# Altium schematic sheet Sheet4.SchDoc
size A1; PageSetup: Record=PageOptions|CenterHorizontal=True|CenterVertical=True|PrintScale=1.00|XCorrection=1.00|YCorrection=1.00|PrintKind=0|BorderSize=5000000|LeftOffset=0|BottomOffset=0|Orientation=2|PaperLength=1000|PaperWidth=1000|Scale=100|PaperSource=7|PrintQuality=-4|MediaType=1|DitherType=10|PaperKind=A4|PrintScaleMode=1
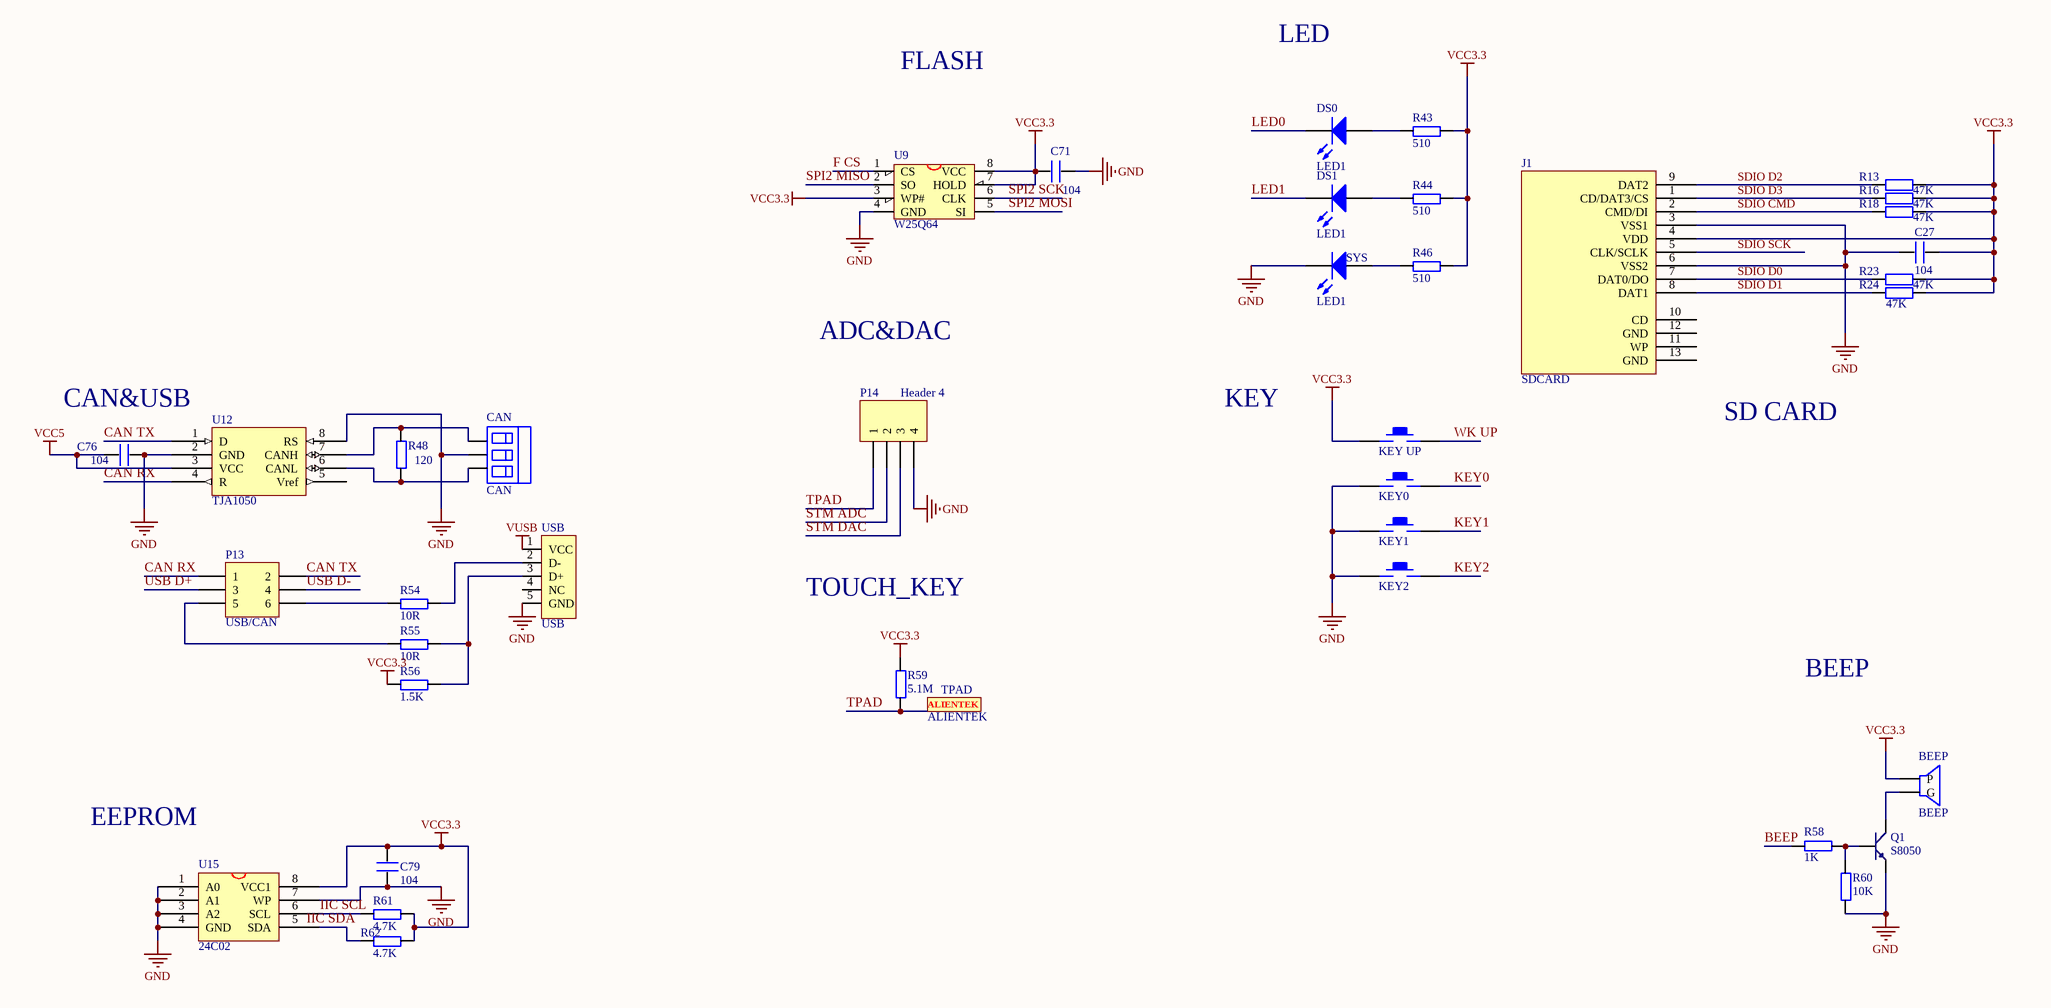
[diagram p0: Sheet4.SchDoc]

## Parts
BEEP  BEEP  [BELL-5]
C27  104  [0603P]
C71  104  [0603P]
C76  104  [0603P]
C79  104  [0603P]
CAN  CAN  [MKDSN_3RMI]
DS0  LED1  [SMDLED]
DS1  LED1  [SMDLED]
J1  SDCARD  [SDCARD_L]
KEY0  KEY_M  [KEY_M]  (value not drawn)
KEY1  KEY_M  [KEY_M]  (value not drawn)
KEY2  KEY_M  [KEY_M]  (value not drawn)
KEY_UP  KEY_M  [KEY_M]  (value not drawn)
P13  USB/CAN  [HDR2X3]
P14  Header 4  [HDR1X4]
Q1  S8050  [SOT-23R]
R13  value 47K  [0603-1]  (hidden comment: Res1)
R16  value 47K  [0603-1]  (hidden comment: Res1)
R18  value 47K  [0603-1]  (hidden comment: Res1)
R23  value 47K  [0603-1]  (hidden comment: Res1)
R24  value 47K  [0603-1]  (hidden comment: Res1)
R43  510  [0603P]
R44  510  [0603P]
R46  510  [0603P]
R48  120  [0603P]
R54  10R  [0603P]
R55  10R  [0603P]
R56  1.5K  [0603P]
R58  1K  [0603P]
R59  5.1M  [0603P]
R60  10K  [0603P]
R61  4.7K  [0603P]
R62  4.7K  [0603P]
SYS  LED1  [SMDLED]
TPAD  ALIENTEK  [ALIENTEK_PAD]
U9  W25Q64  [SOIC-8]
U12  TJA1050  [SOP-8]
U15  24C02  [SOP-8]
USB  USB  [USB/SM0.8-6H5]

## Nets
GND: C27.1 C71.2 C76.2 C79.1 CAN.2 J1.3(VSS1) J1.6(VSS2) KEY0.1 KEY1.1 KEY2.1 P14.4 Q1.1(E) R60.1 SYS.2(K) U9.4(GND) U12.2(GND) U12.8(RS) U15.1(A0) U15.2(A1) U15.3(A2) U15.4(GND) U15.7(WP) USB.5(GND)
VCC3.3: BEEP.1(P) C27.2 C71.1 C79.2 J1.4(VDD) KEY_UP.1 R13.2 R16.2 R18.2 R23.2 R24.2 R43.2 R44.2 R46.2 R56.1 R59.2 R61.2 R62.2 U9.3(WP#) U9.7(HOLD) U9.8(VCC) U15.8(VCC1)
VCC5: C76.1 U12.3(VCC)
VUSB: USB.1(VCC)
BEEP: R58.2
CAN RX: P13.1 U12.4(R)
CAN TX: P13.2 U12.1(D)
F CS: U9.1(CS)
IIC SCL: R61.1 U15.6(SCL)
KEY0: KEY0.2
KEY1: KEY1.2
KEY2: KEY2.2
LED0: DS0.2(K)
LED1: DS1.2(K)
SDIO CMD: J1.2(CMD/DI) R18.1
SDIO D0: J1.7(DAT0/DO) R23.1
SDIO D1: J1.8(DAT1) R24.1
SDIO D2: J1.9(DAT2) R13.1
SDIO D3: J1.1(CD/DAT3/CS) R16.1
SDIO SCK: J1.5(CLK/SCLK)
SPI2 MISO: U9.2(SO)
SPI2 MOSI: U9.5(SI)
SPI2 SCK: U9.6(CLK)
STM ADC: P14.2
STM DAC: P14.3
TPAD: P14.1 R59.1
USB D+: P13.3
USB D-: P13.4
WK UP: KEY_UP.2
NetBEEP_2: BEEP.2(G) Q1.3(C)
NetCAN_1: CAN.1 R48.2 U12.7(CANH)
NetCAN_3: CAN.3 R48.1 U12.6(CANL)
NetDS0_1: DS0.1(A) R43.1
NetDS1_1: DS1.1(A) R44.1
NetP13_5: P13.5 R55.1
NetP13_6: P13.6 R54.1
NetQ1_2: Q1.2(B) R58.1 R60.2
NetR46_1: R46.1 SYS.1(A)
NetR54_2: R54.2 USB.2(D-)
NetR55_2: R55.2 R56.2 USB.3(D+)
NetR62_1: R62.1 U15.5(SDA)

Not connected (* = marked no-connect by the designer): J1 10(CD) 11(WP) 12(GND) 13(GND); U12 5(Vref); USB 4(NC)

## Notes on the sheet
- LED
- FLASH
- ADC&DAC
- CAN&USB
- KEY
- SD CARD
- TOUCH_KEY
- BEEP
- EEPROM
- Labels drawn without touching a wire or pin: IIC SDA

## Library data of the parts
C27 C71 C76 C79 = C
CAN = HEAD3
DS0 DS1 SYS = LED2: Typical RED, GREEN, YELLOW, AMBER GaAs LED; Published: 8-Jun-2000; LatestRevisionDate: 17-Jul-2002; LatestRevisionNote: Re-released for DXP Platform.; PackageDocument: Feb-2002; PackageReference: 3.2X1.6X1.1; Publisher: Altium Limited
J1 = SDCARD: SD卡自弹
P13 = Header 3X2: Header, 3-Pin, Dual row; LatestRevisionDate: 17-Jul-2002; LatestRevisionNote: Re-released for DXP Platform.; Publisher: Altium Limited
P14 = Header 4: Header, 4-Pin; LatestRevisionDate: 17-Jul-2002; LatestRevisionNote: Re-released for DXP Platform.; Publisher: Altium Limited
Q1 = NPN: 8050/BCW846/BCW847
R13 R16 R18 R23 R24 = Res1: 贴片电阻; Published: 8-Jun-2000; LatestRevisionDate: 17-Jul-2002; LatestRevisionNote: Re-released for DXP Platform.; PackageReference: AXIAL-0.4; Publisher: Altium Limited
R43 R44 R46 R48 R54-R56 R58-R62 = R
U9 = W25X16: W25X16;SST25VF016;MX25L1605
U12 = SN65HVD230D
U15 = 24C256
USB = USB5